# Altium schematic sheet Overview.SchDoc: Overview
size A4; DrawnBy: Patrik Staudenmayer; Organization: Altium Limited; Address1: L3, 12a Rodborough Rd; Address2: Frenchs Forest; Address3: NSW; Address4: Australia 2086; DocumentNumber: 2; SheetNumber: 2; SheetTotal: 15
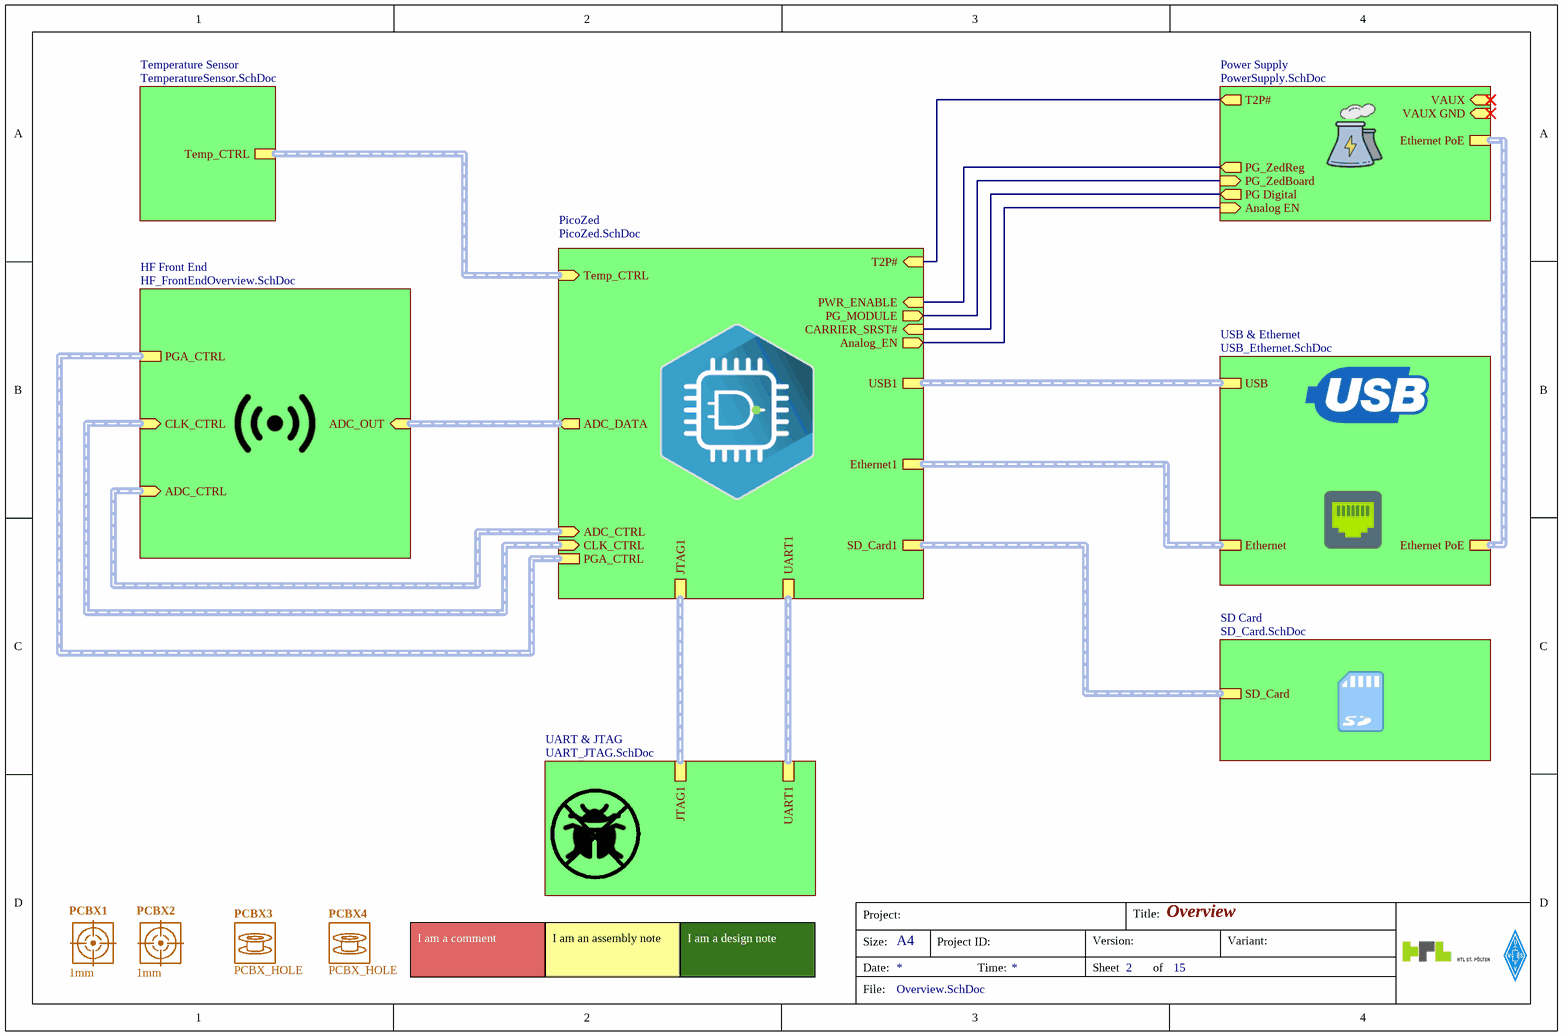
[diagram p0: Overview.SchDoc]

## Parts
PCBX1  1mm  [FIDUCIAL_SINGLESIDE_1mm]  (no BOM)
PCBX2  1mm  [FIDUCIAL_SINGLESIDE_1mm]  (no BOM)
PCBX3  PCBX_HOLE  [TP_FANGFLOCH]  (no BOM)
PCBX4  PCBX_HOLE  [TP_LANGLOCH]  (no BOM)

## Sub-sheets
HF Front End = HF_FrontEndOverview.SchDoc: CLK_CTRL (in, harness CLK_CTRL), ADC_CTRL (in, harness ADC_CTRL), ADC_OUT (in, harness ADC_OUT), PGA_CTRL (harness PGA_CTRL)
PicoZed = PicoZed.SchDoc: USB1 (harness USB), SD_Card1 (harness SD), Ethernet1 (harness Ethernet), JTAG1 (harness JTAG), UART1 (harness UART), PWR_ENABLE (in), PG_MODULE (out), CARRIER_SRST# (in), Analog_EN (out), T2P# (in), ADC_DATA (out, harness ADC_OUT), CLK_CTRL (in, harness CLK_CTRL), ADC_CTRL (in, harness ADC_CTRL), PGA_CTRL, Temp_CTRL (in, harness Temp_CTRL)
Power Supply = PowerSupply.SchDoc: VAUX GND (in), VAUX (in), Ethernet PoE (harness Ethernet PoE), PG Digital (out), PG_ZedBoard (in), PG_ZedReg (out), Analog EN (in), T2P# (out)
SD Card = SD_Card.SchDoc: SD_Card (harness SD)
Temperature Sensor = TemperatureSensor.SchDoc: Temp_CTRL (harness Temp_CTRL)
UART & JTAG = UART_JTAG.SchDoc: JTAG1 (harness JTAG), UART1 (harness UART)
USB & Ethernet = USB_Ethernet.SchDoc: Ethernet PoE (harness Ethernet PoE), Ethernet (harness Ethernet), USB (harness USB)

## Nets
(unnamed): sheet PicoZed/PWR_ENABLE, sheet Power Supply/PG_ZedReg
(unnamed): sheet PicoZed/PG_MODULE, sheet Power Supply/PG_ZedBoard
(unnamed): sheet PicoZed/CARRIER_SRST#, sheet Power Supply/PG Digital
(unnamed): sheet PicoZed/Analog_EN, sheet Power Supply/Analog EN
(unnamed): sheet PicoZed/T2P#, sheet Power Supply/T2P#

## Buses and harness runs
harness sheet HF Front End/ADC_CTRL = sheet PicoZed/ADC_CTRL
harness sheet HF Front End/ADC_OUT = sheet PicoZed/ADC_DATA
harness sheet HF Front End/CLK_CTRL = sheet PicoZed/CLK_CTRL
harness sheet HF Front End/PGA_CTRL = sheet PicoZed/PGA_CTRL
harness sheet PicoZed/Ethernet1 = sheet USB & Ethernet/Ethernet
harness sheet PicoZed/JTAG1 = sheet UART & JTAG/JTAG1
harness sheet PicoZed/SD_Card1 = sheet SD Card/SD_Card
harness sheet PicoZed/Temp_CTRL = sheet Temperature Sensor/Temp_CTRL
harness sheet PicoZed/UART1 = sheet UART & JTAG/UART1
harness sheet PicoZed/USB1 = sheet USB & Ethernet/USB
harness sheet Power Supply/Ethernet PoE = sheet USB & Ethernet/Ethernet PoE

## Notes on the sheet
- I am a comment
- I am an assembly note
- I am a design note
- Project:
- Title:
- Size:
- Date:
- A4
- Project ID:
- Time:
- Sheet
- Version:
- of
- Variant:
- File:

## Library data of the parts
PCBX1 PCBX2 = PCBX_FIDUCIAL: fiducial mark; Prometheus_ID: *; Prometheus_ManPartNo: 1mm; Prometheus_Manufacturer: *; Prometheus_Comment: 1mm; Prometheus_CurrentFootprint: FIDUCIAL_SINGLESIDE_1mm
PCBX3 PCBX4 = PCBX_HOLE: generic PCB hole; Prometheus_ID: *; Prometheus_ManPartNo: PCBX_HOLE; Prometheus_Manufacturer: *; Prometheus_Comment: PCBX_HOLE
  PCBX3: Prometheus_CurrentFootprint: TP_FANGFLOCH
  PCBX4: Prometheus_CurrentFootprint: TP_LANGLOCH